# EAGLE design CDCEmu_Analog (EAGLE 9.6.2)
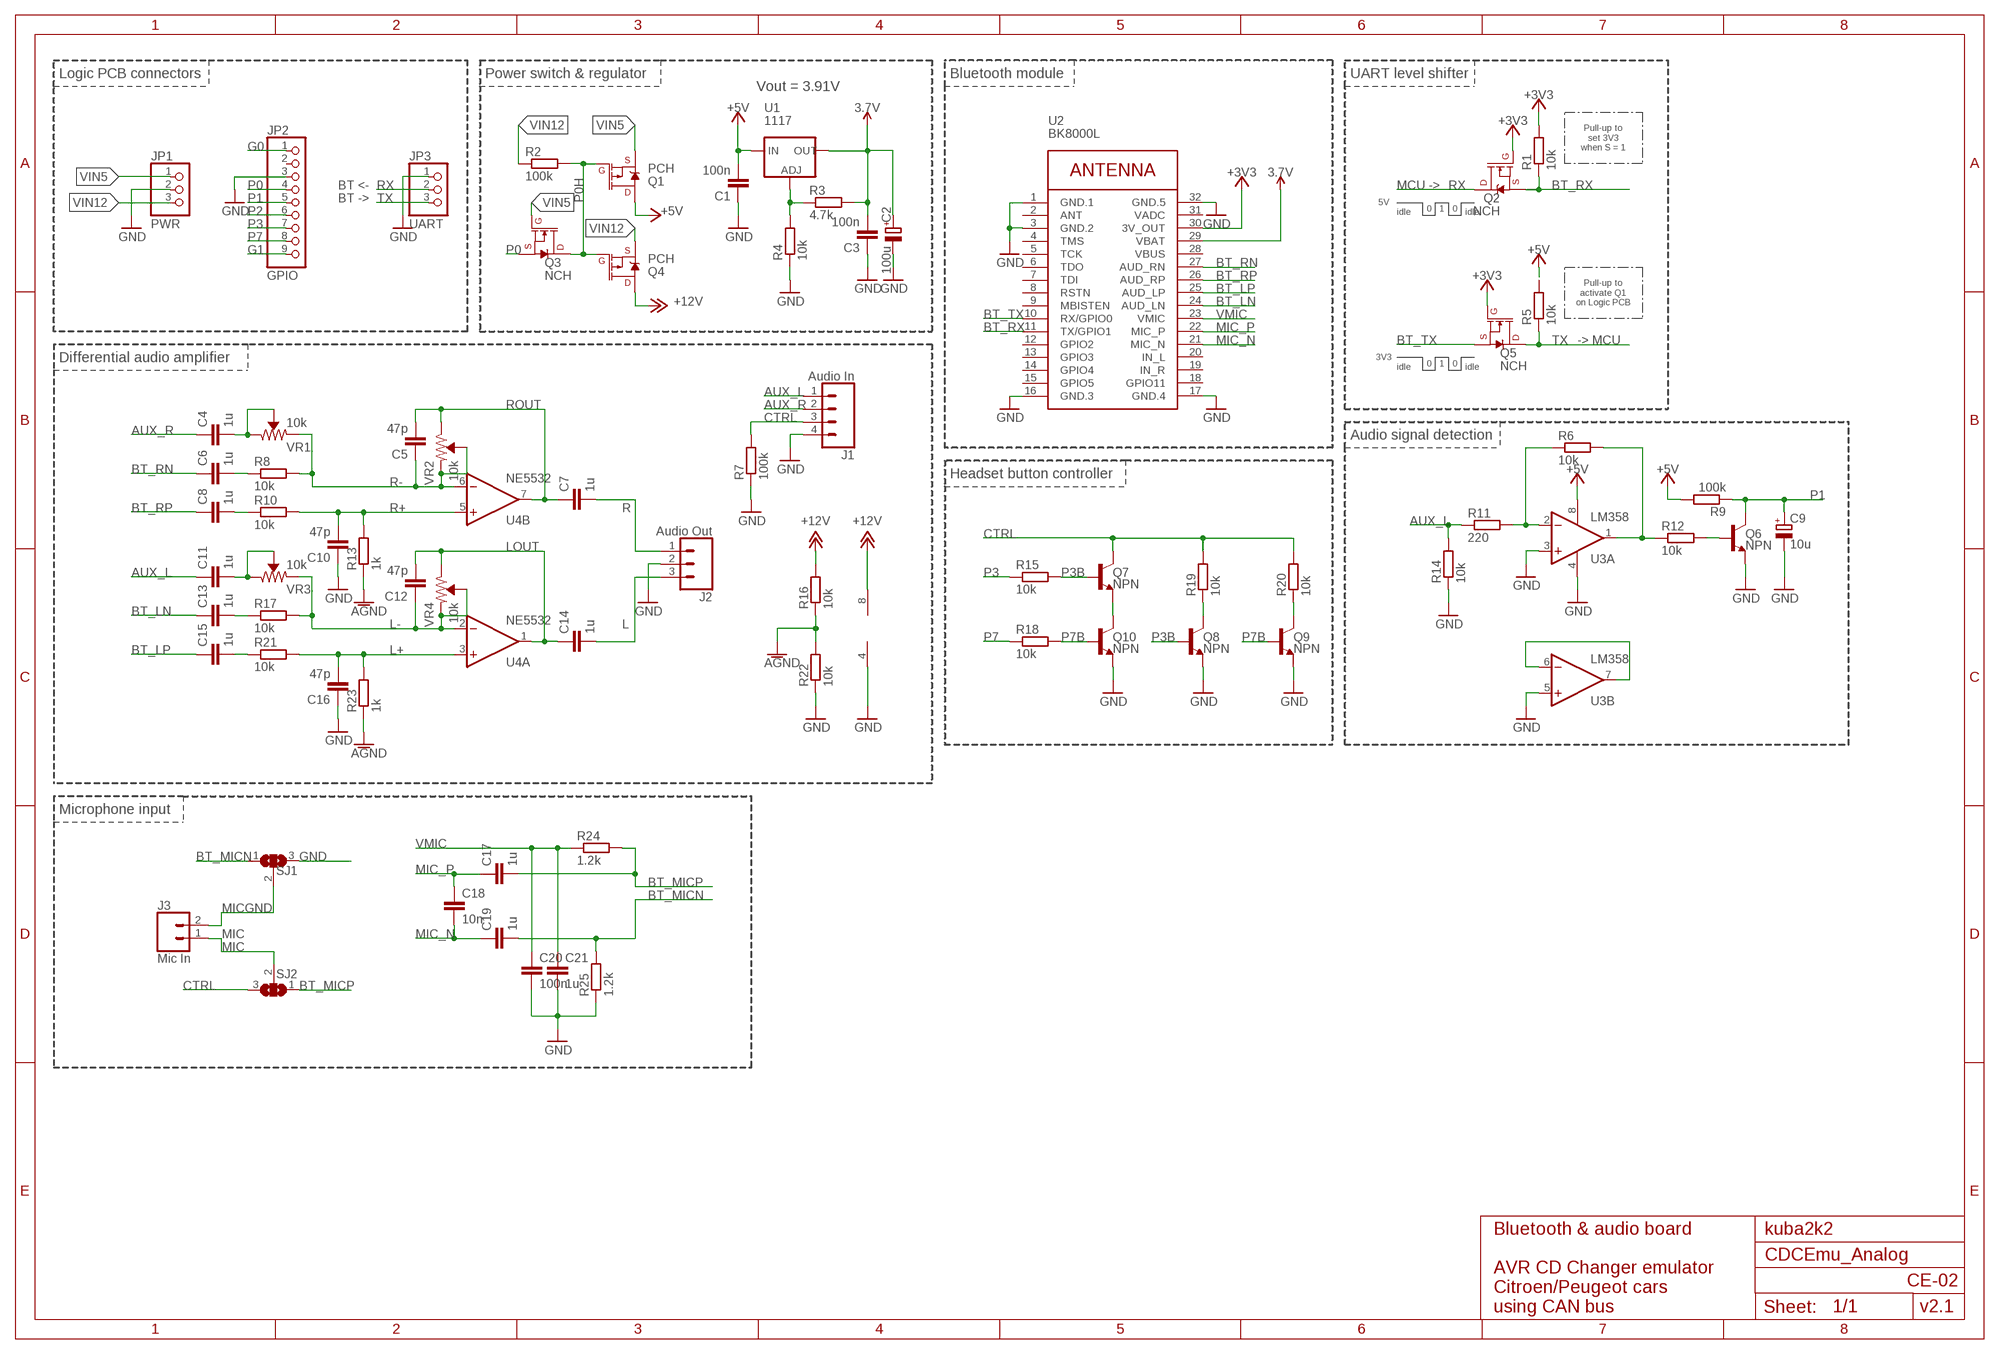
[diagram p0: schematic, sheet 1]

## Parts
C1  100n  C-EUC0805  [C0805]
C2  100u  CPOL-EUSMCB  [SMC_B]
C3  100n  C-EUC0805  [C0805]
C4  1u  C-EUC0805  [C0805]
C5  47p  C-EUC0805  [C0805]
C6  1u  C-EUC0805  [C0805]
C7  1u  C-EUC0805  [C0805]
C8  1u  C-EUC0805  [C0805]
C9  10u  CPOL-EUC1206  [C1206-POL]
C10  47p  C-EUC0805  [C0805]
C11  1u  C-EUC0805  [C0805]
C12  47p  C-EUC0805  [C0805]
C13  1u  C-EUC0805  [C0805]
C14  1u  C-EUC0805  [C0805]
C15  1u  C-EUC0805  [C0805]
C16  47p  C-EUC0805  [C0805]
C17  1u  C-EUC0805  [C0805]
C18  10n  C-EUC0805  [C0805]
C19  1u  C-EUC0805  [C0805]
C20  100n  C-EUC0805  [C0805]
C21  1u  C-EUC0805  [C0805]
J1  Audio In  CONN_04JST-PTH  [JST-4-PTH]
J2  Audio Out  CONN_03JST-PTH  [JST-3-PTH]
J3  Mic In  CONN_02JST-PTH-2  [JST-2-PTH]
JP1  PWR  PINHD-1X3  [1X03]
JP2  GPIO  PINHD-1X9  [1X09]
JP3  UART  PINHD-1X3  [1X03]
Q1  PCH  MOSFET_PCH-IRLML2244  [SOT23-3]
Q2  NCH  MOSFET-NCH-AO3404A  [SOT23-3]
Q3  NCH  MOSFET-NCH-AO3404A  [SOT23-3]
Q4  PCH  MOSFET_PCH-IRLML2244  [SOT23-3]
Q5  NCH  MOSFET-NCH-AO3404A  [SOT23-3]
Q6  NPN  TRANS_NPN-MMBTA42  [SOT23-3]
Q7  NPN  TRANS_NPN-MMBTA42  [SOT23-3]
Q8  NPN  TRANS_NPN-MMBTA42  [SOT23-3]
Q9  NPN  TRANS_NPN-MMBTA42  [SOT23-3]
Q10  NPN  TRANS_NPN-MMBTA42  [SOT23-3]
R1  10k  R-EU_R0805  [R0805]
R2  100k  R-EU_R0805  [R0805]
R3  4.7k  R-EU_R0805  [R0805]
R4  10k  R-EU_R0805  [R0805]
R5  10k  R-EU_R0805  [R0805]
R6  10k  R-EU_R0805  [R0805]
R7  100k  R-EU_R0805  [R0805]
R8  10k  R-EU_R0805  [R0805]
R9  100k  R-EU_R0805  [R0805]
R10  10k  R-EU_R0805  [R0805]
R11  220  R-EU_R0805  [R0805]
R12  10k  R-EU_R0805  [R0805]
R13  1k  R-EU_R0805  [R0805]
R14  10k  R-EU_R0805  [R0805]
R15  10k  R-EU_R0805  [R0805]
R16  10k  R-EU_R0805  [R0805]
R17  10k  R-EU_R0805  [R0805]
R18  10k  R-EU_R0805  [R0805]
R19  10k  R-EU_R0805  [R0805]
R20  10k  R-EU_R0805  [R0805]
R21  10k  R-EU_R0805  [R0805]
R22  10k  R-EU_R0805  [R0805]
R23  1k  R-EU_R0805  [R0805]
R24  1.2k  R-EU_R0805  [R0805]
R25  1.2k  R-EU_R0805  [R0805]
SJ1  SJ2W  [SJ_2]
SJ2  SJ2W  [SJ_2]
U1  1117  V_REG_LM1117SOT223  [SOT223]
U2  BK8000L  WIRELESS-BLUETOOTH-BK8000  [WIRELESS-BLUETOOTH-BK8000]
U3  LM358  LM358D  [SO08]
U4  NE5532  LM358D  [SO08]
VR1  10k  TRIMPOT-SMD-3MM-OPEN-1/10W-25%  [TRIMPOT-SMD-TC33X]
VR2  10k  TRIMPOT-SMD-3MM-OPEN-1/10W-25%  [TRIMPOT-SMD-TC33X]
VR3  10k  TRIMPOT-SMD-3MM-OPEN-1/10W-25%  [TRIMPOT-SMD-TC33X]
VR4  10k  TRIMPOT-SMD-3MM-OPEN-1/10W-25%  [TRIMPOT-SMD-TC33X]

## Nets
3.7V: C2.+ C3.2 R3.2 U1.2(OUT) U1.4(OUT) U2.29(VBAT)
+3V3: Q2.1(G) Q5.1(G) R1.2 U2.30(3V_OUT)
+5V: C1.2 Q1.3(D) R5.2 R9.2 U1.3(IN) U3.8(P:V+)
+12V: Q4.3(D) R16.2 U4.8(P:V+)
ADJ: R3.1 R4.2 U1.1(ADJ)
AGND: R13.1 R16.1 R22.2 R23.1
AUX_L: C11.1 J1.1 R11.1 R14.2
AUX_R: C4.1 J1.2
BT_LN: C13.1 U2.24(AUD_LN)
BT_LP: C15.1 U2.25(AUD_LP)
BT_MICN: C19.2 R25.2 SJ1.1
BT_MICP: C17.2 R24.2 SJ2.1
BT_RN: C6.1 U2.27(AUD_RN)
BT_RP: C8.1 U2.26(AUD_RP)
BT_RX: Q2.2(S) R1.1 U2.11(TX/GPIO1)
BT_TX: Q5.2(S) U2.10(RX/GPIO0)
CCE: Q7.2(E) Q10.3(C)
CTRL: J1.3 Q7.3(C) R7.2 R19.2 R20.2 SJ2.3
DET-: R6.1 R11.2 U3.2(A:-IN)
DET_B: Q6.1(B) R12.2
DETOUT: R6.2 R12.1 U3.1(A:OUT)
G0: JP2.1
G1: JP2.9
GND: C1.1 C2.- C3.1 C9.2(-) C10.1 C16.1 C20.2 C21.2 J1.4 J2.2 JP1.2 JP2.3 JP3.1 Q6.2(E) Q8.2(E) Q9.2(E) Q10.2(E) R4.1 R7.1 R14.1 R22.1 R25.1 SJ1.3 U2.1(GND.1) U2.3(GND.2) U2.16(GND.3) U2.17(GND.4) U2.32(GND.5) U3.3(A:+IN) U3.4(P:V-) U3.5(B:+IN) U4.4(P:V-)
L: C14.2 J2.3
L1: C11.2 VR3.1(CW) VR3.2(WIPER)
L2: C13.2 R17.1
L3: C15.2 R21.1
L+: C16.2 R21.2 R23.2 U4.3(A:+IN)
L-: C12.1 R17.2 U4.2(A:-IN) VR3.3(CCW) VR4.2(WIPER) VR4.3(CCW)
LOUT: C12.2 C14.1 U4.1(A:OUT) VR4.1(CW)
MIC: J3.1 SJ2.2
MIC_N: C18.2 C19.1 U2.21(MIC_N)
MIC_P: C17.1 C18.1 U2.22(MIC_P)
MICGND: J3.2 SJ1.2
P0: JP2.4 Q3.2(S)
P0H: Q1.1(G) Q3.3(D) Q4.1(G) R2.2
P1: C9.1(+) JP2.5 Q6.3(C) R9.1
P2: JP2.6
P3: JP2.7 R15.1
P3B: Q7.1(B) Q8.1(B) R15.2
P7: JP2.8 R18.1
P7B: Q9.1(B) Q10.1(B) R18.2
Q8C: Q8.3(C) R19.1
Q9C: Q9.3(C) R20.1
R: C7.2 J2.1
R1: C4.2 VR1.1(CW) VR1.2(WIPER)
R2: C6.2 R8.1
R3: C8.2 R10.1
R+: C10.2 R10.2 R13.2 U4.5(B:+IN)
R-: C5.1 R8.2 U4.6(B:-IN) VR1.3(CCW) VR2.2(WIPER) VR2.3(CCW)
ROUT: C5.2 C7.1 U4.7(B:OUT) VR2.1(CW)
RX: JP3.2 Q2.3(D)
TX: JP3.3 Q5.3(D) R5.1
U4FB: U3.6(B:-IN) U3.7(B:OUT)
VIN5: JP1.1 Q1.2(S) Q3.1(G)
VIN12: JP1.3 Q4.2(S) R2.1
VMIC: C20.1 C21.1 R24.1 U2.23(VMIC)
Unconnected: JP2.2 U2.2(ANT) U2.4(TMS) U2.5(TCK) U2.6(TDO) U2.7(TDI) U2.8(RSTN) U2.9(MBISTEN) U2.12(GPIO2) U2.13(GPIO3) U2.14(GPIO4) U2.15(GPIO5) U2.18(GPIO11) U2.19(IN_R) U2.20(IN_L) U2.28(VBUS)

## Notes on the sheet
- Logic PCB connectors | Power switch & regulator | Bluetooth module | UART level shifter
- Vout = 3.91V
- Pull-up to
  set 3V3
  when S = 1
- BT <- | MCU ->
- BT -> | 5V
- 0 | 1 | 0
- idle | idle
- Pull-up to
  activate Q1
  on Logic PCB
- -> MCU
- Differential audio amplifier
- 3V3
- 0 | 1 | 0
- idle | idle
- Audio signal detection
- Headset button controller
- Microphone input
- Bluetooth & audio board | kuba2k2
- CE-02
- AVR CD Changer emulator
  Citroen/Peugeot cars
  using CAN bus
- v2.1

## Power pins joined to a net without a drawn wire
VADC: U2.31(VADC)

## Library data of the parts
C1 C3-C8 C10-C21 = rcl:C-EU: CAPACITOR, European symbol; SPICEPREFIX: C
C2 = rcl:CPOL-EU: POLARIZED CAPACITOR, European symbol; SPICEPREFIX: C
C9 = custom:CPOL-EU
J1 = SparkFun-Connectors:CONN_04: Multi connection point. Often used as Generic Header-pin footprint for 0.1 inch spaced/style header connections On any of the 0.1 inch spaced packages, you can populate with these: Break Away Headers - Straight <https://www.sparkfun.com/products/116> (PRT-00116) Break Away Male Headers - Right Angle <https://www.sparkfun.com/products/553> (PRT-00553) Female Headers <https://www.sparkfun.com/products/115> (PRT-00115) Break Away Headers - Machine Pin <https://www.sparkfun.com/products/117> (PRT-00117) Break Away Female Headers - Swiss Machine Pin <https://www.sparkfun.com/products/743> (PRT-00743) For SCREWTERMINALS and SPRING TERMINALS visit here: Screw Terimnals on SparkFun.com <https://www.sparkfun.com/search/results?term=Screw+Terminals> (5mm/3.5mm/2.54mm spacing) This device is also useful as a general connection point to wire up your design to another part of your project. Our various solder wires solder well into these plated through hole pads. Hook-Up Wire - Assortment (Stranded, 22 AWG) <https://www.sparkfun.com/products/11375> (PRT-11375) Hook-Up Wire - Assortment (Solid Core, 22 AWG) <https://www.sparkfun.com/products/11367> (PRT-11367) View the entire wire category on our website here <https://www.sparkfun.com/categories/141> Special notes: Molex polarized connector foot print use with SKU : PRT-08231 with associated crimp pins and housings. 1MM SMD Version SKU: PRT-10208; PROD_ID: WIRE-13531; SF_ID: PRT-09916
J2 = SparkFun-Connectors:CONN_03: Multi connection point. Often used as Generic Header-pin footprint for 0.1 inch spaced/style header connections On any of the 0.1 inch spaced packages, you can populate with these: Break Away Headers - Straight <https://www.sparkfun.com/products/116> (PRT-00116) Break Away Male Headers - Right Angle <https://www.sparkfun.com/products/553> (PRT-00553) Female Headers <https://www.sparkfun.com/products/115> (PRT-00115) Break Away Headers - Machine Pin <https://www.sparkfun.com/products/117> (PRT-00117) Break Away Female Headers - Swiss Machine Pin <https://www.sparkfun.com/products/743> (PRT-00743) Stackable Header - 3 Pin (Female, 0.1") <https://www.sparkfun.com/products/13875> (PRT-13875) For SCREWTERMINALS and SPRING TERMINALS visit here: Screw Terimnals on SparkFun.com <https://www.sparkfun.com/search/results?term=Screw+Terminals> (5mm/3.5mm/2.54mm spacing) This device is also useful as a general connection point to wire up your design to another part of your project. Our various solder wires solder well into these plated through hole pads. Hook-Up Wire - Assortment (Stranded, 22 AWG) <https://www.sparkfun.com/products/11375> (PRT-11375) Hook-Up Wire - Assortment (Solid Core, 22 AWG) <https://www.sparkfun.com/products/11367> (PRT-11367) View the entire wire category on our website here <https://www.sparkfun.com/categories/141> Special notes: Molex polarized connector foot print use with SKU : PRT-08232 with associated crimp pins and housings.; PROD_ID: WIRE-10037; SF_ID: PRT-09915
J3 = SparkFun-Connectors:CONN_02: Multi connection point. Often used as Generic Header-pin footprint for 0.1 inch spaced/style header connections On any of the 0.1 inch spaced packages, you can populate with these: Break Away Headers - Straight <https://www.sparkfun.com/products/116> (PRT-00116) Break Away Male Headers - Right Angle <https://www.sparkfun.com/products/553> (PRT-00553) Female Headers <https://www.sparkfun.com/products/115> (PRT-00115) Break Away Headers - Machine Pin <https://www.sparkfun.com/products/117> (PRT-00117) Break Away Female Headers - Swiss Machine Pin <https://www.sparkfun.com/products/743> (PRT-00743) For SCREWTERMINALS and SPRING TERMINALS visit here: Screw Terimnals on SparkFun.com <https://www.sparkfun.com/search/results?term=Screw+Terminals> (5mm/3.5mm/2.54mm spacing) This device is also useful as a general connection point to wire up your design to another part of your project. Our various solder wires solder well into these plated through hole pads. Hook-Up Wire - Assortment (Stranded, 22 AWG) <https://www.sparkfun.com/products/11375> (PRT-11375) Hook-Up Wire - Assortment (Solid Core, 22 AWG) <https://www.sparkfun.com/products/11367> (PRT-11367) View the entire wire category on our website here <https://www.sparkfun.com/categories/141> Special notes: Molex polarized connector foot print use with: PRT-08233 with associated crimp pins and housings. 2.54_SCREWTERM for use with PRT-10571. 3.5mm Screw Terminal footprints for PRT-08084 5mm Screw Terminal footprints for use with PRT-08432; PROD_ID: CONN-09863; SKU: PRT-09914
JP1 JP3 = pinhead:PINHD-1X3: PIN HEADER
JP2 = pinhead:PINHD-1X9: PIN HEADER
Q1 Q4 = SparkFun-DiscreteSemi:MOSFET_PCH: P-channel MOSFETs Voltage controlled devices that allow control of high current outputs. SparkFun Products: SparkFun ESP32 Thing <https://www.sparkfun.com/products/13907> SparkFun ESP8266 Thing <https://www.sparkfun.com/products/13231> SparkFun Pi Servo HAT V2 <https://www.sparkfun.com/products/15316> DMG2305UX-7 (20V/4.2A/SOT23-3); PROD_ID: TRANS-11153; VALUE: 4.3A/20V/54mΩ
Q2 Q3 Q5 = SparkFun-DiscreteSemi:MOSFET-NCH: N-channel MOSFETs Voltage controlled devices that allow control of high current outputs. SparkFun Products: SparkFun OpenScale <https://www.sparkfun.com/products/13261> SparkFun Digital Sandbox <https://www.sparkfun.com/products/12651> SparkFun Monster Moto Shield <https://www.sparkfun.com/products/10182> SparkFun MOSFET Power Controller <https://www.sparkfun.com/products/11214>; PROD_ID: TRANS-12988; VALUE: 5.8A/30V/35mΩ
Q6-Q10 = SparkFun-DiscreteSemi:TRANS_NPN: NPN transistor Current controlled devices typically used to amplify current or used as a switch. BC547 - COM-08928 <http://www.sparkfun.com/products/8928> (TO-92 45V 100mA) (1.Collector 2.Base 3.Emitter) 2N3904 - COM-00521 <http://www.sparkfun.com/products/521> (TO-92 40V 200mA) (1.Emitter 2.Base 3.Collector) P2N2222A - COM-12852 <http://www.sparkfun.com/products/12852> (TO-92 40V 600mA) (1.Collector 2.Base 3.Emitter); PROD_ID: TRANS-09116; VALUE: 500mA/300V
R1-R25 = rcl:R-EU_: RESISTOR, European symbol; SPICEPREFIX: R
SJ1 SJ2 = jumper:SJ2W: SMD solder JUMPER
U1 = SparkFun-IC-Power:V_REG_LM1117: Voltage Regulator LM1117 Standard adjustable voltage regulator but in SMD form. Spark Fun Electronics SKU : COM-00595; PROD_ID: VREG-08170
U2 = diy-modules:WIRELESS-BLUETOOTH-BK8000: Bluetooth Audio Module based on BK8000L chip More details available here: http://www.electrodragon.com/w/BK8000L Click here to find device on ebay.com <http://www.ebay.com/sch/bk8000l+module>
U3 U4 = custom:LM358: OP AMP also LM158; LM258; LM2904 Source: http://cache.national.com/ds/LM/LM158.pdf
VR1-VR4 = SparkFun-Resistors:TRIMPOT: Trimming Potentiometer (Trimpot) Three-terminal potentiometers, with an adjustable wiper and two adjustable resistors. A pot can be used to create a configurable voltage divider, or as a variable resistor. "Trimpots" are a subset of potentiometers, usually intended for "set-and-forget" applications. They're often more delicate than standard potentiometers - rated for fewer turns. Variants PTH-KNOB - PTH Trimpot w/ finger-adjustable knob Trimpot 10K with Knob <https://www.sparkfun.com/products/9806> (COM-09806) Datasheet <http://www.sparkfun.com/datasheets/Components/General/TSR-3386.pdf> SMD-3MM-CLOSED-FRAME - SMD 3mm Square Closed-Frame Trimpot Used on e.g. EasyDriver - Stepper Motor Driver <https://www.sparkfun.com/products/12779> Datasheet <http://www.bitechnologies.com/pdfs/22.pdf> (22AR10KTR) SMD-5MM - SMD 5mm Square Closed-Frame Trimpot Used on e.g. IOIO-OTG - V2.2 <https://www.sparkfun.com/products/13613> Datasheet <http://www.vishay.com/docs/51008/ts53.pdf> (TS53YL502MR10) SMD-3MM-1/10W-25% - 3mm Square Open-Frame Trimpot Used on e.g. SparkFun Shapeoko <https://www.sparkfun.com/products/13899> Datasheet <http://www.bourns.com/docs/Product-Datasheets/TC33.pdf> (TC33X-2-103E); PROD_ID: RES-12428, RES-08048

## Board
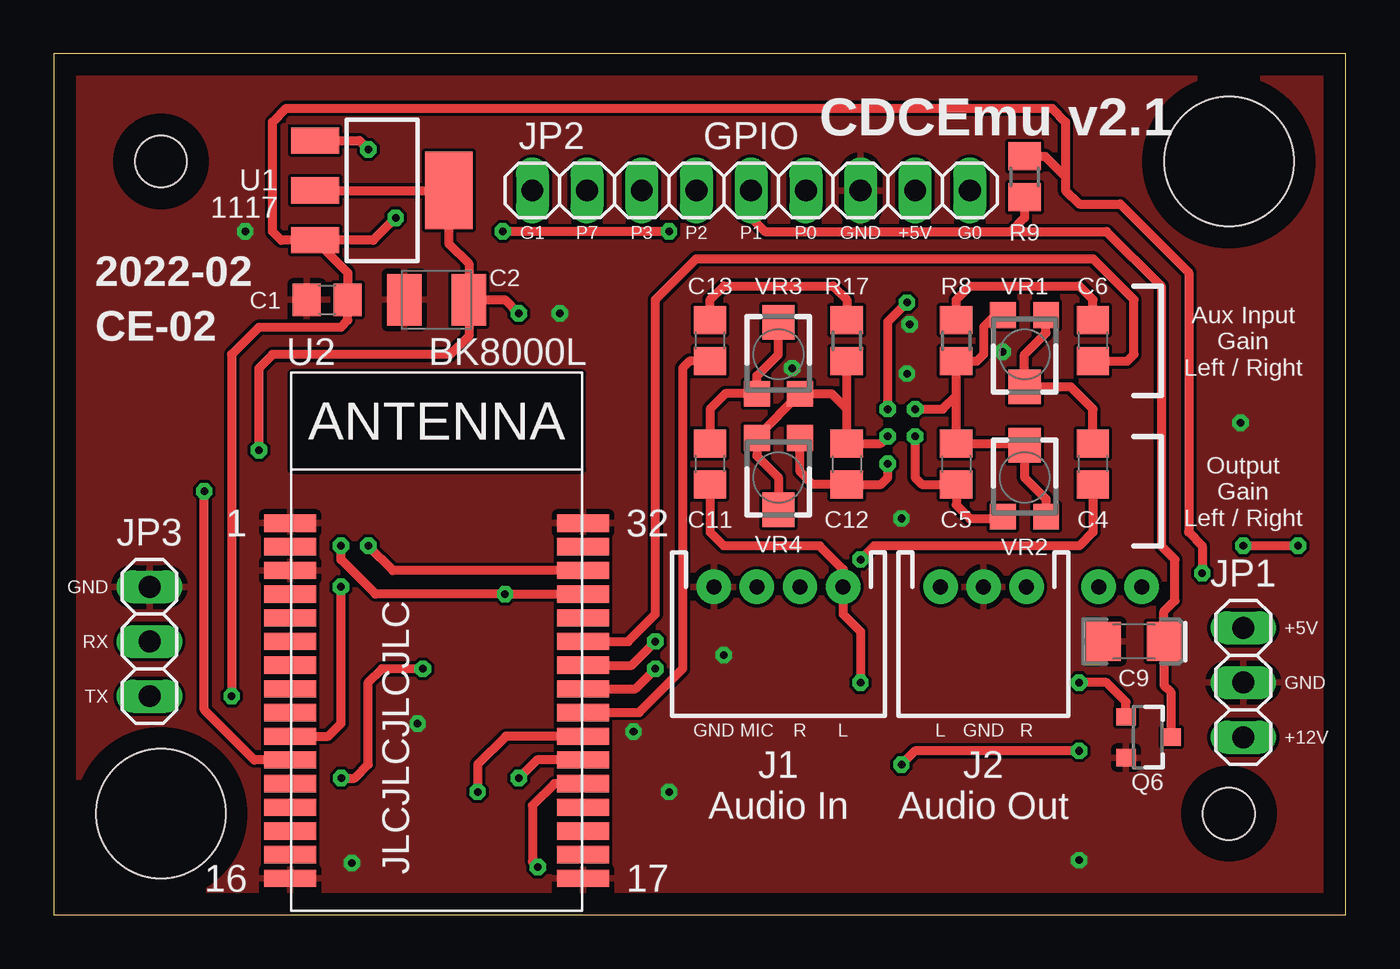
[diagram p1: board, top side]
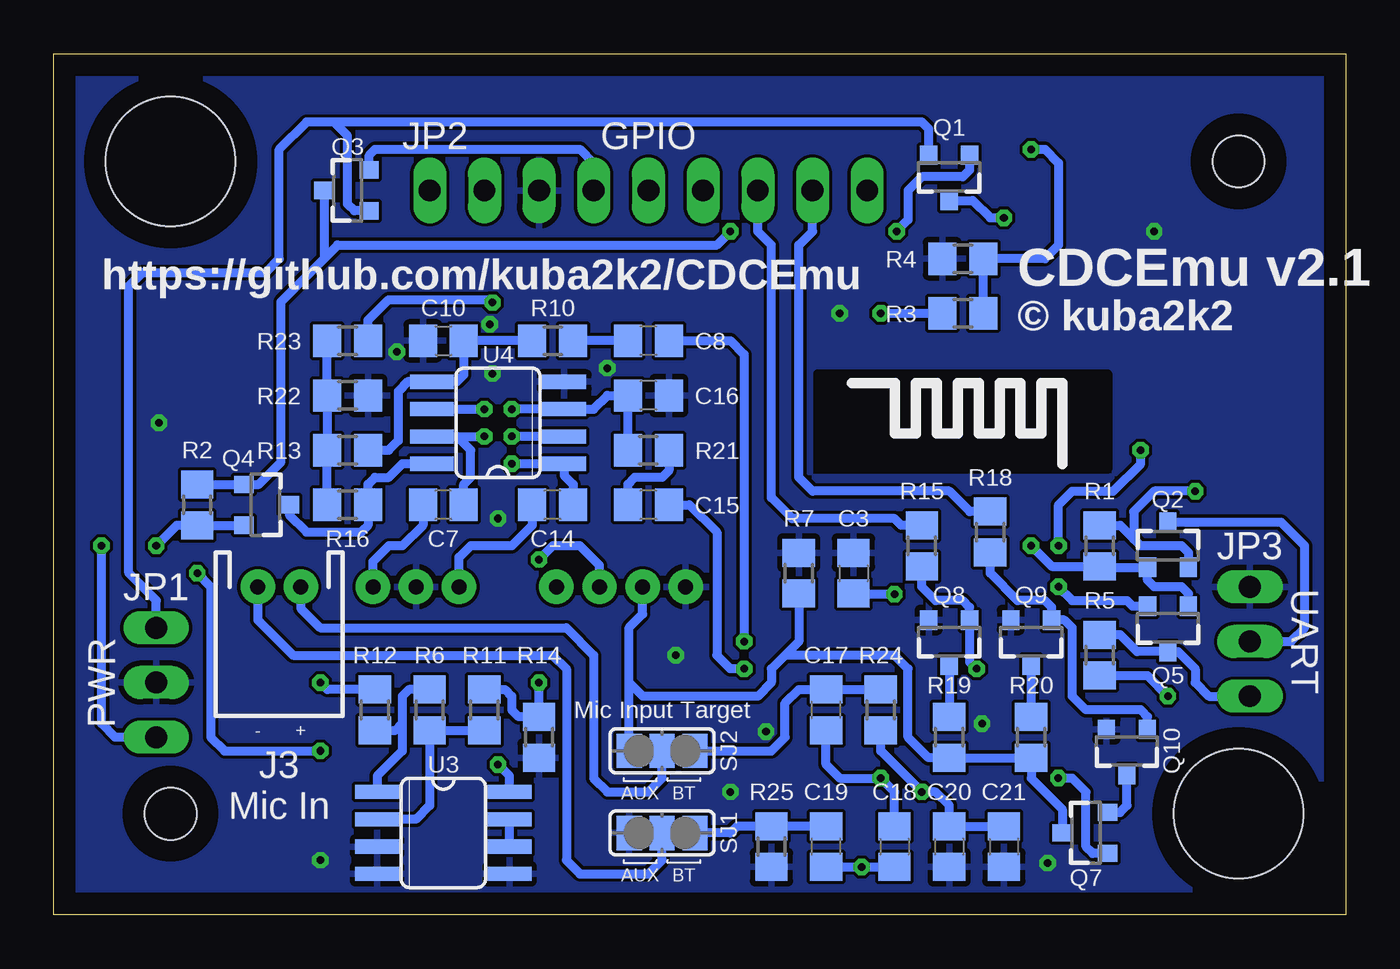
[diagram p2: board, bottom side, seen from below]

Size 60 x 40 mm. Coordinates in mm from the lower left corner, seen from the top.
Outline: 0,0 60,0 60,40 0,40 0,0
Copper layers (1*16): Top 0.035mm / dielectric 1.5mm / Bottom 0.035mm
Design rules "default *": minimum track width 6mil, minimum drill 0.35mm, track to track 6mil, track to pad 6mil, pad to pad 6mil, via to via 6mil, smd to smd 6mil, copper to edge 40mil, drill to drill 6mil, minimum pad ring 10mil, minimum via ring 8mil, stop-mask expansion 4mil, vias tented up to drill 16mil, thermal gap 10mil
Holes 6 mm at 4.97,4.7 54.58,35
Holes 2.4 mm at 4.97,35 54.58,4.7
tKeepout: area 11,0.3 to 24.5,20.7
tRestrict: area 11,20.7 to 24.5,25.1
bRestrict: area 11,20.7 to 24.5,25.1

### Footprints (pad centres in the part's own frame; a part is rotated, then mirrored left to right if it is on the bottom)
C0805 = smd 1.3 x 1.5: 1 -0.95,0; 2 0.95,0
SMC_B = smd 1.6 x 2.4: + -1.5,0; - 1.5,0
C1206-POL = smd 1.6 x 1.8: 1 -1.4,0; 2 1.4,0
JST-4-PTH = drill 0.7 pad 1.6: 1 -3,0; 2 -1,0; 3 1,0; 4 3,0
JST-3-PTH = drill 0.7 pad 1.6: 1 -2,0; 2 0,0; 3 2,0
JST-2-PTH = drill 0.7 pad 1.6: 1 -1,0; 2 1,0
1X03 = drill 1.016 long: 1 -2.54,0; 2 0,0; 3 2.54,0
1X09 = drill 1.016 long: 1 -10.16,0; 2 -7.62,0; 3 -5.08,0; 4 -2.54,0; 5 0,0; 6 2.54,0; 7 5.08,0; 8 7.62,0; 9 10.16,0
SOT23-3 = smd 0.8 x 0.9: 1 -0.95,-1; 2 0.95,-1; 3 0,1.1
R0805 = smd 1.3 x 1.5: 1 -0.95,0; 2 0.95,0
SJ_2 = smd 1.168 x 1.6: 1 -1.524,0; 2 0,0; 3 1.524,0
SOT223 = smd 1.219 x 2.235: 1 -2.311,-3.099; 2 0,-3.099; 3 2.311,-3.099 | smd 3.6 x 2.2: 4 0,3.099
WIRELESS-BLUETOOTH-BK8000 = smd 2.4 x 0.8: 1 -6.8,5.5; 2 -6.8,4.4; 3 -6.8,3.3; 4 -6.8,2.2; 5 -6.8,1.1; 6 -6.8,0; 7 -6.8,-1.1; 8 -6.8,-2.2; 9 -6.8,-3.3; 10 -6.8,-4.4; 11 -6.8,-5.5; 12 -6.8,-6.6; 13 -6.8,-7.7; 14 -6.8,-8.8; 15 -6.8,-9.9; 16 -6.8,-11; 17 6.8,-11; 18 6.8,-9.9; 19 6.8,-8.8; 20 6.8,-7.7; 21 6.8,-6.6; 22 6.8,-5.5; 23 6.8,-4.4; 24 6.8,-3.3; 25 6.8,-2.2; 26 6.8,-1.1; 27 6.8,0; 28 6.8,1.1; 29 6.8,2.2; 30 6.8,3.3; 31 6.8,4.4; 32 6.8,5.5
SO08 = smd 0.66 x 2.032: 1 -1.905,-3.073; 2 -0.635,-3.073; 3 0.635,-3.073; 4 1.905,-3.073; 5 1.905,3.073; 6 0.635,3.073; 7 -0.635,3.073; 8 -1.905,3.073
TRIMPOT-SMD-TC33X = smd 1.2 x 1.2: 1 -1,-1.825; 3 1,-1.825 | smd 1.5 x 1.6: 2 0,1.5

### Placement (x,y rotation side)
C1  12.7,28.57 0 top
C2  17.78,28.57 180 top
C3  22.86,15.88 270 bottom
C4  48.26,20.95 90 top
C5  41.91,20.95 270 top
C6  48.26,26.67 90 top
C7  41.91,19.05 180 bottom
C8  32.38,26.67 180 bottom
C9  50.16,12.7 180 top
C10  41.91,26.67 0 bottom
C11  30.48,20.95 90 top
C12  36.83,20.95 270 top
C13  30.48,26.67 90 top
C14  36.83,19.05 180 bottom
C15  32.38,19.05 180 bottom
C16  32.38,24.13 180 bottom
C17  24.13,9.53 90 bottom
C18  20.95,3.17 270 bottom
C19  24.13,3.17 90 bottom
C20  18.41,3.17 270 bottom
C21  15.88,3.17 270 bottom
J1  33.66,15.24 180 top
J2  43.18,15.24 180 top
J3  49.53,15.24 180 bottom
JP1  55.24,10.79 270 top
JP2  32.38,33.66 180 top
JP3  4.45,12.7 270 top
Q1  18.41,34.29 180 bottom
Q2  8.26,17.14 0 bottom
Q3  46.35,33.66 90 bottom
Q4  50.16,19.05 270 bottom
Q5  8.26,13.34 180 bottom
Q6  50.8,8.26 270 top
Q7  12.06,3.81 90 bottom
Q8  18.41,12.7 180 bottom
Q9  14.61,12.7 180 bottom
Q10  10.16,7.62 180 bottom
R1  11.43,17.14 270 bottom
R2  53.34,19.05 90 bottom
R3  17.78,27.94 180 bottom
R4  17.78,30.48 0 bottom
R5  11.43,12.06 270 bottom
R6  42.55,9.53 90 bottom
R7  25.4,15.88 270 bottom
R8  41.91,26.67 270 top
R9  45.09,34.29 90 top
R10  36.83,26.67 180 bottom
R11  40.01,9.53 270 bottom
R12  45.09,9.53 90 bottom
R13  46.35,21.59 0 bottom
R14  37.47,8.26 90 bottom
R15  19.68,17.14 270 bottom
R16  46.35,19.05 0 bottom
R17  36.83,26.67 270 top
R18  16.51,17.78 270 bottom
R19  18.41,8.26 270 bottom
R20  14.61,8.26 270 bottom
R21  32.38,21.59 180 bottom
R22  46.35,24.13 180 bottom
R23  46.35,26.67 0 bottom
R24  21.59,9.53 90 bottom
R25  26.67,3.17 90 bottom
SJ1  31.75,3.81 180 bottom
SJ2  31.75,7.62 180 bottom
U1  15.24,33.66 270 top
U2  17.78,12.7 0 top
U3  41.91,3.81 270 bottom
U4  39.37,22.86 90 bottom
VR1  45.09,26.04 180 top
VR2  45.09,20.32 0 top
VR3  33.66,26.04 0 top
VR4  33.66,20.32 180 top

### Tracks (layer width: path | path; a pad name or v marks a point on that pad's centre or on a via)
3.7V  (via drill 0.35, 0.35 pad 0.6)
  Top 0.406: U2.29 v20.95,14.9 14.95,14.9 13.34,16.51 v13.34,17.14 | U1.2 U1.4 18.34,31.19 19.28,30.25 C2.+ | v9.53,21.59 9.53,25.4 10.16,26.04 18.41,26.04 19.28,26.9 C2.+ | C2.+ 20.95,28.57 v21.59,27.94
  Bottom 0.406: v13.34,17.14 13.34,19.05 12.7,19.68 10.79,19.68 9.53,20.95 v9.53,21.59 | R3.2 v21.59,27.94 | C3.2 22.84,14.9 v20.95,14.9
+3V3  (via drill 0.35)
  Top 0.406: U2.30 15.75,16 v14.61,17.14
  Bottom 0.406: Q5.1 7.3,14.93 7.62,15.24 8.89,15.24 9.21,15.55 Q2.1 11.38,16.14 R1.2 13.65,16.2 v14.61,17.14
+5V  (via drill 0.35)
  Top 0.406: v15.88,32.38 14.83,31.34 U1.3 | U1.3 13.65,29.84 C1.2 13.65,27.62 13.34,27.3 9.53,27.3 8.26,26.04 v8.26,10.16 | U1.3 10.57,31.34 10.16,31.75 10.16,36.83 10.79,37.47 46.35,37.47 46.99,36.83 46.99,34.29 | 46.99,34.29 46.99,33.66 47.62,33.02 49.53,33.02 52.7,29.84 52.7,17.78 53.34,17.14 v53.34,15.88 | v47.62,7.62 40.01,7.62 v39.37,6.99 | 46.99,34.29 46.04,35.24 R9.2
  Bottom 0.406: v15.88,32.38 16.51,32.38 17.32,33.19 Q1.3 | R5.2 9.21,11.12 v8.26,10.16 | v53.34,15.88 52.7,15.24 52.7,8.26 52.07,7.62 v47.62,7.62 | U3.8 38.84,6.45 v39.37,6.99
+12V
  Bottom 0.406: U4.8 43.81,20.95 44.45,20.32 45.09,20.32 45.41,20 R16.2 45.41,18.09 45.72,17.78 48.26,17.78 49.06,18.59 Q4.3
ADJ  (via drill 0.35)
  Top 0.406: U1.1 14.2,35.97 v14.61,35.56
  Bottom 0.406: R3.1 R4.2 13.97,30.48 13.34,31.11 13.34,34.92 13.97,35.56 v14.61,35.56
AGND
  Bottom 0.406: R23.1 R22.2 R13.1 R16.1
AUX_L  (via drill 0.35)
  Top 0.406: C11.1 30.48,17.78 31.11,17.14 35.56,17.14 36.66,16.05 J1.1 36.66,13.97 37.47,13.16 v37.47,10.79
  Bottom 0.406: v37.47,10.79 R14.2 38.41,9.21 38.73,9.53 38.73,10.16 39.05,10.47 R11.1
AUX_R  (via drill 0.35)
  Top 0.406: v37.47,16.51 38.1,17.14 47.62,17.14 48.26,17.78 C4.1
  Bottom 0.406: J1.2 34.66,16.24 35.56,17.14 36.83,17.14 v37.47,16.51
BT_LN
  Top 0.406: U2.24 27.18,9.4 29.21,11.43 29.21,25.4 29.53,25.72 C13.1
BT_LP  (via drill 0.35)
  Top 0.406: v27.94,11.43 27.01,10.5 U2.25
  Bottom 0.406: v27.94,11.43 28.57,11.43 29.21,12.06 29.21,17.78 30.48,19.05 C15.1
BT_MICN
  Bottom 0.406: C19.2 R25.2 28.26,4.12 28.57,3.81 SJ1.1
BT_MICP
  Bottom 0.406: R24.2 C17.2 25.4,10.47 26.04,9.84 26.04,8.26 26.67,7.62 SJ2.1
BT_RN
  Top 0.406: U2.27 26.67,12.7 27.94,13.97 27.94,28.57 29.84,30.48 48.26,30.48 50.16,28.57 50.16,26.04 49.85,25.72 C6.1
BT_RP  (via drill 0.35)
  Top 0.406: v27.94,12.7 26.84,11.6 U2.26
  Bottom 0.406: v27.94,12.7 27.94,26.04 28.57,26.67 C8.1
BT_RX  (via drill 0.35)
  Top 0.406: v6.99,19.68 6.99,9.53 9.31,7.2 U2.11
  Bottom 0.406: v6.99,19.68 8.89,19.68 9.84,18.73 9.84,17.46 | Q2.2 7.3,16.83 7.62,17.14 9.53,17.14 9.84,17.46 | 9.84,17.46 10.47,18.09 R1.1
BT_TX  (via drill 0.35)
  Top 0.406: v13.34,15.24 13.34,8.89 12.74,8.3 U2.10
  Bottom 0.406: Q5.2 9.89,14.34 10.16,14.61 12.7,14.61 v13.34,15.24
CCE
  Bottom 0.406: Q10.3 10.16,5.08 10.48,4.76 Q7.2
CTRL
  Bottom 0.406: 26.04,12.06 20.95,12.06 20.32,11.43 20.32,8.26 19.37,7.3 R19.2 R20.2 14.61,6.35 13.16,4.91 Q7.3 | 26.04,12.06 26.67,11.43 26.67,10.79 27.3,10.16 32.64,10.16 33.27,10.79 | R7.2 25.4,12.7 26.04,12.06 | SJ2.3 33.27,10.79 | 33.27,10.79 33.27,13.35 32.66,13.97 J1.3
DET-
  Bottom 0.406: R11.2 R6.1 42.55,5.08 43.18,4.45 U3.2
DET_B  (via drill 0.35)
  Top 0.406: v47.62,10.79 48.9,10.79 49.8,9.89 Q6.1
  Bottom 0.406: R12.2 47.3,10.47 v47.62,10.79
DETOUT
  Bottom 0.406: U3.1 44.98,6.45 43.81,7.62 43.81,8.89 | 43.81,8.89 43.81,10.16 43.5,10.47 R6.2 | R12.1 44.13,8.57 43.81,8.89
GND  (via drill 0.35)
  other vias: 39.62,25.15 44.07,26.16 8.89,31.75 39.75,27.43 34.29,25.4 28.57,5.71 47.62,2.54 31.11,12.06 39.37,18.41 13.84,2.41 16.89,8.89 26.92,8.51 23.5,27.94 55.12,22.86
  pour Top (rank 2): 0,0 60,0 60,40 0,40
  pour Bottom (rank 2): 0,0 60,0 60,40 0,40
L
  Bottom 0.406: J2.3 41.18,16.61 40.64,17.14 38.73,17.14 37.78,18.1 C14.2
L1
  Top 0.406: C11.2 30.48,23.5 31.2,24.21 VR3.1 32.66,25.04 33.66,26.04 VR3.2
L2
  Top 0.406: C13.2 30.48,28.57 31.11,29.21 36.2,29.21 36.83,28.57 R17.1
L3
  Bottom 0.406: C15.2 33.34,20 33.02,20.32 31.75,20.32 31.43,20.64 R21.1
L+  (via drill 0.35)
  Top 0.406: v38.73,23.5 38.73,27.56 v39.62,28.45
  Bottom 0.406: R21.2 C16.2 34.29,24.13 34.92,23.5 U4.3 v38.73,23.5 | R23.2 45.41,27.62 44.45,28.57 39.75,28.57 v39.62,28.45
L-  (via drill 0.35)
  Top 0.406: v38.73,22.23 38.41,21.91 C12.1 36.83,23.5 | 36.83,23.5 R17.2 | 36.83,23.5 36.12,24.21 VR3.3 32.66,22.21 VR4.3 32.66,21.32 33.66,20.32 VR4.2
  Bottom 0.406: U4.2 v38.73,22.23
LOUT  (via drill 0.35)
  Top 0.406: v38.73,20.95 38.73,20.32 38.42,20 C12.2 35.24,20 34.66,20.59 VR4.1
  Bottom 0.406: v38.73,20.95 U4.1 36.3,20.42 35.88,20 C14.1
MIC
  Bottom 0.406: J3.1 48.53,14.24 47.62,13.34 36.2,13.34 34.92,12.06 34.92,6.35 34.29,5.71 32.38,5.71 31.75,6.35 SJ2.2
MIC_N  (via drill 0.35)
  Top 0.406: U2.21 23.25,6.1 22.23,5.08 22.23,2.48 v22.48,2.23
  Bottom 0.406: C19.1 v22.48,2.23 C18.2
MIC_P  (via drill 0.35)
  Top 0.406: v21.59,6.35 22.44,7.2 U2.22
  Bottom 0.406: C17.1 24.13,6.99 23.5,6.35 v21.59,6.35 20.95,5.71 C18.1
MICGND
  Bottom 0.406: J3.2 50.53,13.7 48.9,12.06 36.83,12.06 36.2,11.43 36.2,2.54 35.56,1.91 32.38,1.91 31.75,2.54 SJ1.2
P0
  Bottom 0.406: JP2.4 34.92,34.92 35.56,35.56 45.09,35.56 45.35,35.29 Q3.2
P0H  (via drill 0.35)
  Top 0.406: v28.57,31.75 v20.86,31.75
  Bottom 0.406: Q3.3 47.45,30.48 | 47.45,30.48 49.45,28.49 49.45,21.04 50.48,20 Q4.1 R2.2 | Q1.1 17.46,34.6 17.78,34.29 19.68,34.29 20.32,33.66 20.32,32.29 v20.86,31.75 | 47.45,30.48 46.82,31.11 29.21,31.11 v28.57,31.75
P1
  Top 0.406: JP2.5 32.38,32.38 33.02,31.75 44.45,31.75 | 44.45,31.75 48.9,31.75 51.44,29.21 51.44,17.14 52.07,16.51 52.07,14.61 51.56,14.1 C9.1 51.56,10.66 51.9,10.33 Q6.3 | R9.1 45.09,32.38 44.45,31.75
P3
  Bottom 0.406: JP2.7 27.3,31.75 26.67,31.11 26.67,19.39 25.7,18.41 20.95,18.41 20.64,18.1 R15.1
P3B  (via drill 0.35)
  Top 0.406: v13.35,6.35 13.97,6.35 14.61,6.99 14.61,10.79 15.24,11.43 v17.14,11.43
  Bottom 0.406: R15.2 19.68,15.24 19.05,14.61 17.78,14.61 17.46,14.29 Q8.1 17.46,11.75 v17.14,11.43 | Q7.1 11.75,2.86 12.06,3.17 12.06,5.71 12.7,6.35 v13.35,6.35
P7
  Bottom 0.406: JP2.8 24.77,31.75 25.4,31.11 25.4,20.32 24.77,19.68 18.41,19.68 17.46,18.73 R18.1
P7B
  Bottom 0.406: R18.2 16.51,15.88 15.24,14.61 13.97,14.61 13.65,14.29 Q9.1 13.07,13.7 12.7,13.34 12.7,10.16 12.06,9.53 9.53,9.53 9.21,9.21 Q10.1
Q8C
  Bottom 0.406: Q8.3 R19.1
Q9C
  Bottom 0.406: R20.1 Q9.3
R
  Bottom 0.406: J2.1 45.18,16.41 44.45,17.14 43.81,17.14 42.86,18.1 C7.2
R1
  Top 0.406: VR1.1 46.09,27.04 45.09,26.04 VR1.2 47.22,24.54 48.26,23.5 C4.2
R2
  Top 0.406: C6.2 48.26,28.57 47.62,29.21 42.55,29.21 41.91,28.57 R8.1
R3
  Bottom 0.406: C8.2 R10.1
R+
  Bottom 0.406: R10.2 C10.2 40.96,25.08 41.27,24.77 U4.5 43.56,24.77 44.01,24.32 44.01,22.04 44.45,21.59 R13.2
R-  (via drill 0.35)
  Top 0.406: 41.91,24.13 C5.1 45,21.91 VR2.2 45.09,20.32 46.09,19.32 VR2.3 | 41.91,24.13 R8.2 42.87,25.72 43.18,26.04 43.18,27.3 43.73,27.86 VR1.3 | v40.01,23.5 41.27,23.5 41.91,24.13
  Bottom 0.406: U4.6 v40.01,23.5
ROUT  (via drill 0.35)
  Top 0.406: v40.01,22.23 40.01,20.32 40.32,20 C5.2 41.91,19.05 42.55,18.41 44.01,18.41 VR2.1
  Bottom 0.406: U4.7 41.27,22.23 | 41.27,22.23 v40.01,22.23 | C7.1 40.96,20 40.64,20.32 40.64,21.59 41.27,22.23
RX
  Bottom 0.406: JP3.2 2.54,12.7 1.91,13.34 1.91,17.14 2.86,18.1 3,18.25 Q2.3
TX
  Bottom 0.406: R5.1 10.47,13.02 9.7,12.23 Q5.3 7.79,12.23 6.99,11.43 6.99,10.79 6.35,10.16 JP3.3
U4FB
  Bottom 0.406: U3.6 U3.7
VIN5
  Bottom 0.406: JP1.1 55.24,14.61 56.52,15.88 56.52,29.21 55.88,29.84 50.16,29.84 49.53,30.48 49.53,35.56 48.26,36.83 46.99,36.83 | Q3.1 46.04,32.7 46.35,33.02 46.35,36.2 46.99,36.83 | Q1.2 19.36,36.51 19.68,36.83 46.99,36.83
VIN12  (via drill 0.35)
  Top 0.406: v57.78,17.14 v55.24,17.14
  Bottom 0.406: JP1.3 57.15,8.26 57.78,8.89 v57.78,17.14 | Q4.2 R2.1 54.29,18.1 v55.24,17.14
VMIC  (via drill 0.35)
  Top 0.406: U2.23 21,8.3 19.68,6.99 v19.68,5.71
  Bottom 0.406: C20.1 18.41,4.45 | C20.1 C21.1 | R24.1 21.59,7.62 v19.68,5.71 19.05,5.71 18.41,5.08 C20.1

### Text on the board
tPlace: CDCEmu v2.1 | G1 | P7 | P3 | P2 | P1 | P0 | GND | +5V | G0 | 2022-02 | CE-02 | Aux Input / Gain / Left / Right | Output / Gain / Left / Right | GND | RX | +5V | GND | TX | GND | MIC | R | L | L | GND | R | JLCJLCJLCJLC | +12V
bPlace: GPIO | JP2 | https://github.com/kuba2k2/CDCEmu | CDCEmu v2.1 | © kuba2k2 | JP3 | JP1 | UART | PWR | Mic Input Target | + | -
bNames: BT | AUX | BT | AUX